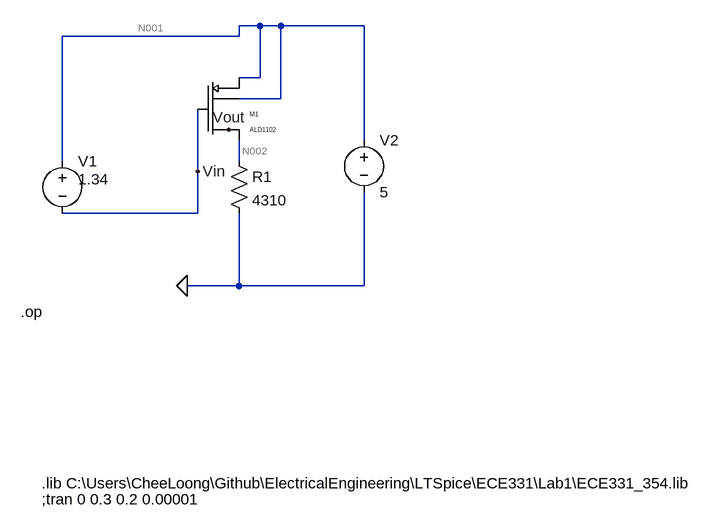
[diagram p0: schematic Lab1_2_3_Soon_Wang.asc]
Lab1_2_3_Soon_Wang.asc, the LTspice schematic file:
Version 4
SHEET 1 908 680
WIRE -208 -176 -240 -176
WIRE -176 -176 -208 -176
WIRE -48 -176 -176 -176
WIRE -240 -160 -240 -176
WIRE -240 -160 -512 -160
WIRE -208 -96 -208 -176
WIRE -208 -96 -240 -96
WIRE -176 -64 -176 -176
WIRE -176 -64 -240 -64
WIRE -48 0 -48 -176
WIRE -512 32 -512 -160
WIRE -240 32 -240 0
WIRE -304 48 -304 -48
WIRE -304 112 -304 48
WIRE -304 112 -512 112
WIRE -240 224 -240 112
WIRE -240 224 -320 224
WIRE -48 224 -48 80
WIRE -48 224 -240 224
FLAG -320 224 0
FLAG -256 -16 Vout
FLAG -304 48 Vin
SYMBOL voltage -512 16 R0
WINDOW 123 0 0 Left 2
WINDOW 39 0 0 Left 2
WINDOW 3 24 44 Left 2
SYMATTR Value 1.34
SYMATTR InstName V1
SYMBOL res -256 16 R0
SYMATTR InstName R1
SYMATTR Value 4310
SYMBOL voltage -48 -16 R0
WINDOW 123 0 0 Left 2
WINDOW 39 0 0 Left 2
SYMATTR InstName V2
SYMATTR Value 5
SYMBOL ALD1102 -304 -96 R0
SYMATTR InstName M1
TEXT -544 528 Left 2 !.lib C:\\Users\\CheeLoong\\Github\\ElectricalEngineering\\LTSpice\\ECE331\\Lab1\\ECE331_354.lib
TEXT -544 552 Left 2 !;tran 0 0.3 0.2 0.00001
TEXT -576 264 Left 2 !.op

The netlist it stands for:
* Lab1_2_3_Soon_Wang.asc
V1 N001 Vin 1.34
R1 N002 0 4310
V2 N001 0 5
M1 N002 Vin N001 N001 ALD1102 W=1.739e-3 L=1e-6
.model NMOS NMOS
.model PMOS PMOS
.lib standard.mos
.lib C:\Users\CheeLoong\Github\ElectricalEngineering\LTSpice\ECE331\Lab1\ECE331_354.lib
;tran 0 0.3 0.2 0.00001
.op
.backanno
.end

* Results of the author's LTspice run, read from the files saved beside the schematic
* Operating Point:
*   V(n001) = 5 V
*   V(vin) = 3.66 V
*   V(n002) = 2.372 V
*   Id(M1) = -550.4 µA
*   Ig(M1) = 0 A
*   Ib(M1) = 2.623 pA
*   Is(M1) = 550.4 µA
*   I(R1) = 550.4 µA
*   I(V2) = -550.4 µA
*   I(V1) = 0 A
* From the log:
*   Semiconductor Device Operating Points:
*                           --- MOSFET Transistors ---
*   Name:          m1
*   Model:       ald1102
*   Id:         -5.50e-04
*   Vgs:        -1.34e+00
*   Vds:        -2.63e+00
*   Vbs:         0.00e+00
*   Vth:        -7.67e-01
*   Vdsat:      -4.60e-01
*   Gm:          1.53e-03
*   Gds:         2.81e-05
*   Gmb:         4.24e-04
*   Cbd:         0.00e+00
*   Cbs:         0.00e+00
*   Cgsov:       2.00e-12
*   Cgdov:       2.00e-12
*   Cgbov:       0.00e+00
*   Cgs:         4.00e-12
*   Cgd:         0.00e+00
*   Cgb:         0.00e+00